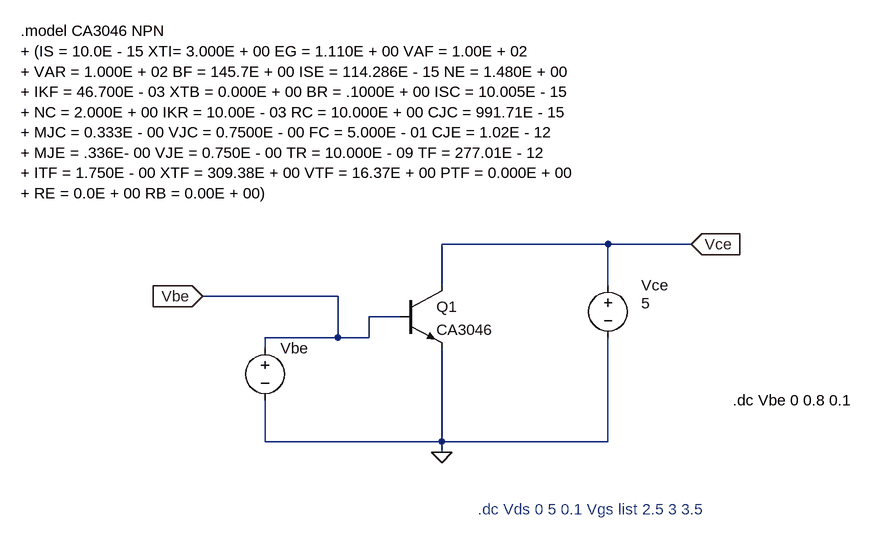
[diagram p0: schematic Simu_D.asc]
Simu_D.asc, the LTspice schematic file:
Version 4.1
SHEET 1 1600 960
WIRE 512 448 256 448
WIRE 640 448 512 448
WIRE 256 512 256 448
WIRE 512 512 512 448
WIRE 96 528 -112 528
WIRE 192 560 144 560
WIRE 96 592 96 528
WIRE 96 592 -16 592
WIRE 144 592 144 560
WIRE 144 592 96 592
WIRE -16 608 -16 592
WIRE -16 752 -16 688
WIRE 256 752 256 608
WIRE 256 752 -16 752
WIRE 512 752 512 592
WIRE 512 752 256 752
WIRE 256 768 256 752
FLAG 256 768 0
FLAG 640 448 Vce
IOPIN 640 448 In
FLAG -112 528 Vbe
IOPIN -112 528 In
SYMBOL voltage -16 592 R0
WINDOW 3 55 46 Left 2
SYMATTR Value ""
SYMATTR Value2 AC 1
SYMATTR InstName Vbe
SYMBOL voltage 512 496 R0
WINDOW 39 0 0 Left 0
WINDOW 3 51 43 Left 2
WINDOW 0 51 15 Left 2
SYMATTR Value 5
SYMATTR InstName Vce
SYMATTR Value2 AC 1
SYMBOL lib\\sym\\npn 192 512 R0
SYMATTR InstName Q1
SYMATTR Value CA3046
TEXT -392 120 Left 2 !.model CA3046 NPN\n+ (IS = 10.0E - 15 XTI= 3.000E + 00 EG = 1.110E + 00 VAF = 1.00E + 02\n+ VAR = 1.000E + 02 BF = 145.7E + 00 ISE = 114.286E - 15 NE = 1.480E + 00\n+ IKF = 46.700E - 03 XTB = 0.000E + 00 BR = .1000E + 00 ISC = 10.005E - 15\n+ NC = 2.000E + 00 IKR = 10.00E - 03 RC = 10.000E + 00 CJC = 991.71E - 15\n+ MJC = 0.333E - 00 VJC = 0.7500E - 00 FC = 5.000E - 01 CJE = 1.02E - 12\n+ MJE = .336E- 00 VJE = 0.750E - 00 TR = 10.000E - 09 TF = 277.01E - 12\n+ ITF = 1.750E - 00 XTF = 309.38E + 00 VTF = 16.37E + 00 PTF = 0.000E + 00\n+ RE = 0.0E + 00 RB = 0.00E + 00)
TEXT 312 856 Left 2 ;.dc Vds 0 5 0.1 Vgs list 2.5 3 3.5
TEXT 704 688 Left 2 !.dc Vbe 0 0.8 0.1

The netlist it stands for:
* Simu_D.asc
Vbe Vbe 0 AC 1
Vce Vce 0 5 AC 1
Q1 Vce Vbe 0 0 CA3046
.model NPN NPN
.model PNP PNP
.lib standard.bjt
.model CA3046 NPN
+ (IS = 10.0E - 15 XTI= 3.000E + 00 EG = 1.110E + 00 VAF = 1.00E + 02
+ VAR = 1.000E + 02 BF = 145.7E + 00 ISE = 114.286E - 15 NE = 1.480E + 00
+ IKF = 46.700E - 03 XTB = 0.000E + 00 BR = .1000E + 00 ISC = 10.005E - 15
+ NC = 2.000E + 00 IKR = 10.00E - 03 RC = 10.000E + 00 CJC = 991.71E - 15
+ MJC = 0.333E - 00 VJC = 0.7500E - 00 FC = 5.000E - 01 CJE = 1.02E - 12
+ MJE = .336E- 00 VJE = 0.750E - 00 TR = 10.000E - 09 TF = 277.01E - 12
+ ITF = 1.750E - 00 XTF = 309.38E + 00 VTF = 16.37E + 00 PTF = 0.000E + 00
+ RE = 0.0E + 00 RB = 0.00E + 00)
* .dc Vds 0 5 0.1 Vgs list 2.5 3 3.5
.dc Vbe 0 0.8 0.1
.backanno
.end